# Altium schematic sheet ESP8266_base5.1-2.SchDoc
size A
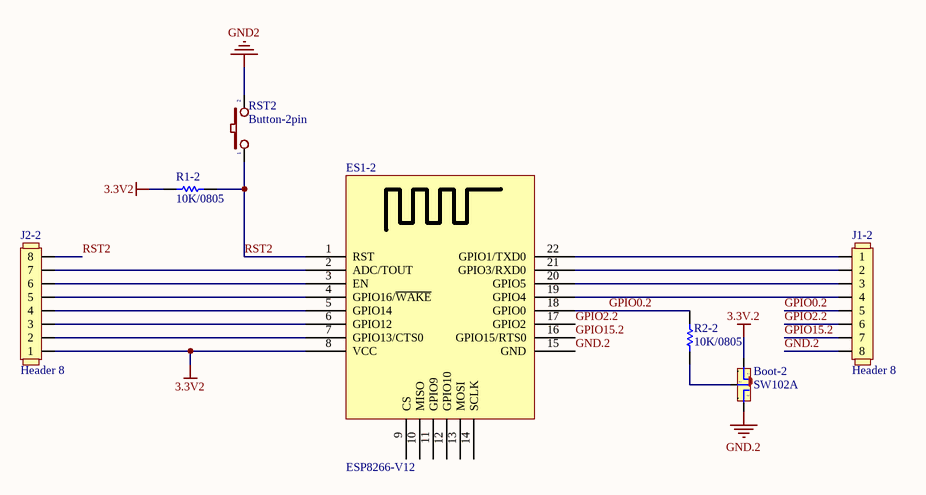
[diagram p0: ESP8266_base5.1-2.SchDoc]

## Parts
Boot-2  SW102A  [SW102]
ES1-2  ESP8266-V12  [ESP-8266 V12]
J1-2  Header 8  [HEADER x8]
J2-2  Header 8  [HEADER x8]
R1-2  10K/0805  [Res 0805(2012)]
R2-2  10K/0805  [Res 0805(2012)]
RST2  Button-2pin  [BUTTON_2P_SMD]

## Nets
3.3V2: ES1-2.8(VCC) J2-2.1 R1-2.2
3.3V.2: Boot-2.1
GND2: RST2.2
GND.2: Boot-2.3 ES1-2.15(GND) J1-2.8
GPIO0.2: ES1-2.18(GPIO0) J1-2.5 R2-2.1
GPIO2.2: ES1-2.17(GPIO2) J1-2.6
GPIO15.2: ES1-2.16(GPIO15/RTS0) J1-2.7
RST2: ES1-2.1(RST) J2-2.8 R1-2.1 RST2.1
NetBoot-2_2: Boot-2.2 R2-2.2
NetES1-2_2: ES1-2.2(ADC/TOUT) J2-2.7
NetES1-2_3: ES1-2.3(EN) J2-2.6
NetES1-2_4: ES1-2.4(GPIO16/~{WAKE}) J2-2.5
NetES1-2_5: ES1-2.5(GPIO14) J2-2.4
NetES1-2_6: ES1-2.6(GPIO12) J2-2.3
NetES1-2_7: ES1-2.7(GPIO13/CTS0) J2-2.2
NetES1-2_19: ES1-2.19(GPIO4) J1-2.4
NetES1-2_20: ES1-2.20(GPIO5) J1-2.3
NetES1-2_21: ES1-2.21(GPIO3/RXD0) J1-2.2
NetES1-2_22: ES1-2.22(GPIO1/TXD0) J1-2.1

Not connected (* = marked no-connect by the designer): Boot-2 4 5; ES1-2 9(CS) 10(MISO) 11(GPIO9) 12(GPIO10) 13(MOSI) 14(SCLK)

## Library data of the parts
Boot-2 = SW102A: Switch 102 on Broad; Value: Switch 102 On Board
R1-2 R2-2 = Resistor 0805